# Altium schematic sheet FOTA MicroController Core.SchDoc: FOTA MicroController
size 292 x 193 mm; DocumentNumber: 45; SheetNumber: 30; SheetTotal: 42
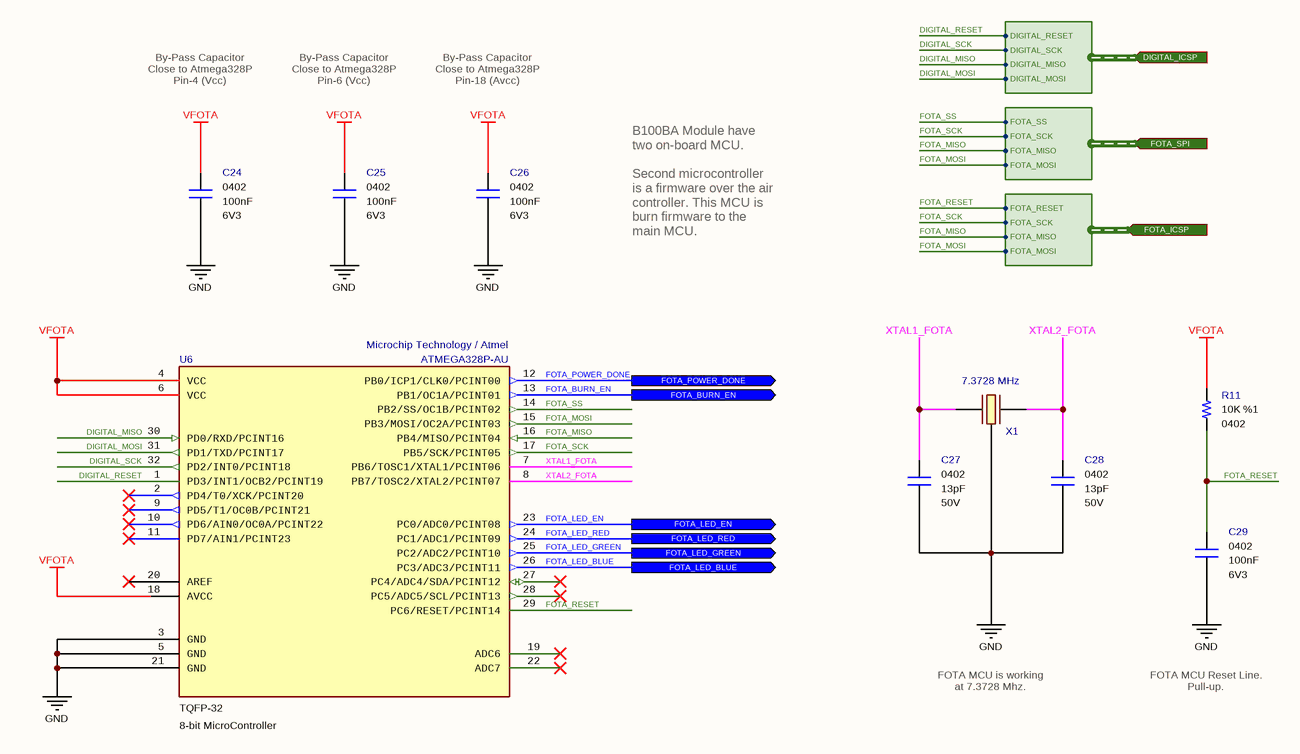
[diagram p0: FOTA MicroController Core.SchDoc]

## Parts
C24  value 100nF  Case: 0402  Voltage: 6V3  [CAPACITOR_0402]  (hidden comment: Multilayer Ceramic Capacitor)
C25  value 100nF  Case: 0402  Voltage: 6V3  [CAPACITOR_0402]  (hidden comment: Multilayer Ceramic Capacitor)
C26  value 100nF  Case: 0402  Voltage: 6V3  [CAPACITOR_0402]  (hidden comment: Multilayer Ceramic Capacitor)
C27  value 13pF  Voltage: 50V  Case: 0402  [CAPACITOR_0402]  (hidden comment: Multilayer Ceramic Capacitor)
C28  value 13pF  Voltage: 50V  Case: 0402  [CAPACITOR_0402]  (hidden comment: Multilayer Ceramic Capacitor)
C29  value 100nF  Case: 0402  Voltage: 6V3  [CAPACITOR_0402]  (hidden comment: Multilayer Ceramic Capacitor)
R11  value 10K  Tolerance: %1  Case: 0402  [RESISTOR_0402]  (hidden comment: Thick Film Resistor)
U6  8-bit MicroController  Case: TQFP-32  Manufacturer Part Number: ATMEGA328P-AU  Manufacturer Name: Microchip Technology / Atmel  [TQFP32]
X1  7.3728 MHz  [ABRACON_CRYSTAL]

## Ports
DIGITAL_ICSP (in, harness DIGITAL_ICSP), FOTA_BURN_EN (out), FOTA_ICSP (in, harness FOTA_ICSP), FOTA_LED_BLUE (out), FOTA_LED_EN (out), FOTA_LED_GREEN (out), FOTA_LED_RED (out), FOTA_POWER_DONE (out), FOTA_SPI (in, harness FOTA_SPI)

## Harnesses
FOTA_ICSP: FOTA_MOSI, FOTA_MISO, FOTA_SCK, FOTA_RESET
FOTA_SPI: FOTA_MOSI, FOTA_MISO, FOTA_SCK, FOTA_SS
DIGITAL_ICSP: DIGITAL_MOSI, DIGITAL_MISO, DIGITAL_SCK, DIGITAL_RESET

## Nets
GND: C24.1 C25.1 C26.1 C27.1 C28.1 C29.1 U6.3(GND) U6.5(GND) U6.21(GND) X1.2(GND)
VFOTA: C24.2 C25.2 C26.2 R11.2 U6.4(VCC) U6.6(VCC) U6.18(AVCC)
DIGITAL_MISO: U6.30(PD0/RXD/PCINT16) ; port DIGITAL_ICSP.DIGITAL_MISO
DIGITAL_MOSI: U6.31(PD1/TXD/PCINT17) ; port DIGITAL_ICSP.DIGITAL_MOSI
DIGITAL_RESET: U6.1(PD3/INT1/OCB2/PCINT19) ; port DIGITAL_ICSP.DIGITAL_RESET
DIGITAL_SCK: U6.32(PD2/INT0/PCINT18) ; port DIGITAL_ICSP.DIGITAL_SCK
FOTA_BURN_EN: U6.13(PB1/OC1A/PCINT01) ; port FOTA_BURN_EN
FOTA_LED_BLUE: U6.26(PC3/ADC3/PCINT11) ; port FOTA_LED_BLUE
FOTA_LED_EN: U6.23(PC0/ADC0/PCINT08) ; port FOTA_LED_EN
FOTA_LED_GREEN: U6.25(PC2/ADC2/PCINT10) ; port FOTA_LED_GREEN
FOTA_LED_RED: U6.24(PC1/ADC1/PCINT09) ; port FOTA_LED_RED
FOTA_MISO: U6.16(PB4/MISO/PCINT04) ; port FOTA_ICSP.FOTA_MISO, port FOTA_SPI.FOTA_MISO
FOTA_MOSI: U6.15(PB3/MOSI/OC2A/PCINT03) ; port FOTA_ICSP.FOTA_MOSI, port FOTA_SPI.FOTA_MOSI
FOTA_POWER_DONE: U6.12(PB0/ICP1/CLK0/PCINT00) ; port FOTA_POWER_DONE
FOTA_RESET: C29.2 R11.1 U6.29(PC6/RESET/PCINT14) ; port FOTA_ICSP.FOTA_RESET
FOTA_SCK: U6.17(PB5/SCK/PCINT05) ; port FOTA_ICSP.FOTA_SCK, port FOTA_SPI.FOTA_SCK
FOTA_SS: U6.14(PB2/SS/OC1B/PCINT02) ; port FOTA_SPI.FOTA_SS
XTAL1_FOTA: C27.2 U6.7(PB6/TOSC1/XTAL1/PCINT06) X1.3(OUT/IN)
XTAL2_FOTA: C28.2 U6.8(PB7/TOSC2/XTAL2/PCINT07) X1.1(IN/OUT)

Not connected (* = marked no-connect by the designer): U6 2(PD4/T0/XCK/PCINT20)* 9(PD5/T1/OC0B/PCINT21)* 10(PD6/AIN0/OC0A/PCINT22)* 11(PD7/AIN1/PCINT23)* 19(ADC6)* 20(AREF)* 22(ADC7)* 27(PC4/ADC4/SDA/PCINT12)* 28(PC5/ADC5/SCL/PCINT13)*; X1 4(GND)

## Notes on the sheet
- By-Pass Capacitor
  Close to Atmega328P
  Pin-4 (Vcc)
- By-Pass Capacitor
  Close to Atmega328P
  Pin-6 (Vcc)
- By-Pass Capacitor
  Close to Atmega328P
  Pin-18 (Avcc)
- B100BA Module have two on-board MCU.
  Second microcontroller is a firmware over the air controller. This MCU is burn firmware to the main MCU.
- FOTA MCU is working at 7.3728 Mhz.
- FOTA MCU Reset Line. Pull-up.
- © 2021 All rights reserved.
  This document may not, in whole or in part, be copied, photocopied, reproduced, translated or converted to any electronic or machine readable from without prior written permission of Mehmet Günce Akkoyun.
  Engineer contact : akkoyun@me.com
- Property of
- Engineer :
- Date :
- Size :
- A4
- Time :
- Project :
- Page :
- /
- Customer :
- Product ID :
- Module ID :
- Version :
- File :
- Revision :

## Library data of the parts
C24-C26 C29 = Capacitor - 100nF [0402-6V3]: Capacitor - 100nF [0402-6V3] (Ceramic); Manufacturer Name: AVX; Manufacturer Part Number: 04026D104KAT4A; Dielectric: X5R; Tolerance: %10; Height: 0.25mm; ComponentLink1Description: Mouser; ComponentLink1URL: https://www.mouser.com.tr/ProductDetail/AVX/04026D104KAT4A?qs=sGAEpiMZZMs0AnBnWHyRQPg4iYkCw7IMED%2F4kpqgf7w%3D; ComponentLink2Description: DataSheet; ComponentLink2URL: https://www.mouser.com.tr/datasheet/2/40/cx5r-776519.pdf; ROHS: Yes; Maximum Operating Temperature: +85; Minimum Operating Temperature: -55; Supplier 1: Avnet; Supplier Part Number 1: 04026D104KAT4A; Mouser Part Number: 581-04026D104KAT4A
C27 C28 = Capacitor - 13pF [0402-50V]: Capacitor - 13pF [0402] (Ceramic); Manufacturer Name: Kemet; Manufacturer Part Number: CBR04C130F5GAC; Dielectric: C0G; Tolerance: 1%; Height: 0.55mm; ROHS: Yes; Weight: 0.65mg; ComponentLink1Description: DataSheet; ComponentLink1URL: http://www.kemet.com/Lists/ProductCatalog/Attachments/490/KEM_C1030_CBR_SMD.pdf; ComponentLink2Description: Mouser; ComponentLink2URL: http://www.mouser.com/Search/ProductDetail.aspx?qs=kSX8PZDGYstn%252bRHasf81FA%3d%3d; Supplier 1: Mouser; Supplier 2: Farnell; Supplier 3: Digi-Key; Supplier Part Number 3: 399-8812-1-ND; Supplier Part Number 2: 2773390; Supplier Part Number 1: 80-CBR04C130F5GAC; Mouser Part Number: 80-CBR04C130F5GAC
R11 = Resistor - 10K: Thick Film Resistors - SMD 1/16 W 10 Kohms 1%; Manufacturer Name: Vishay; Manufacturer Part Number: CRCW040210K0FKED; Height: 0.4mm; ComponentLink1Description: DataSheet; ComponentLink1URL: https://www.mouser.com.tr/datasheet/2/427/dcrcwe3-1762152.pdf; ComponentLink2Description: Mouser; ComponentLink2URL: https://www.mouser.com.tr/ProductDetail/Vishay-Dale/CRCW040210K0FKED?qs=sGAEpiMZZMu61qfTUdNhG2DpbjADlD3GcalbOv9utCY%3D; Supplier 1: Mouser; Supplier 2: Digi-Key; Supplier Part Number 1: 71-CRCW040210K0FKEDH; Supplier Part Number 2: 541-10.0KYCT-ND; Mouser Part Number: 71-CRCW0402-10K-E3
U6 = IC - ATMEGA328P: 8-bit Microcontrollers - MCU 32KB In-system Flash 20MHz 1.8V-5.5V; Supply Voltage - Min: 1.8V; Supply Voltage - Max: 5.5V; Height: 1mm; ComponentLink1Description: DataSheet; ComponentLink1URL: http://ww1.microchip.com/downloads/en/DeviceDoc/ATmega48A-PA-88A-PA-168A-PA-328-P-DS-DS40002061A.pdf; ROHS: Yes; Minimum Operating Temperature: -40; Maximum Operating Temperature: +85; ComponentLink2Description: Mouser; ComponentLink2URL: https://www.mouser.com.tr/ProductDetail/Microchip-Technology-Atmel/ATMEGA328P-AU?qs=sGAEpiMZZMtVoztFdqDXO3RbBx7FKCmV; ComponentLink3Description: ProductPage; ComponentLink3URL: https://www.microchip.com/wwwproducts/en/ATmega328p; Supplier 1: Avnet; Supplier 2: Mouser; Supplier 3: Arrow; Supplier 4: Digi-Key; Supplier Part Number 1: ATMEGA328P-AU; Supplier Part Number 2: 556-ATMEGA328P-AU; Supplier Part Number 3: ATMEGA328P-AU; Supplier Part Number 4: ATMEGA328P-AU-ND; Mouser Part Number: 556-ATMEGA328P-AU
X1 = Crystal - 7.3728 MHz (Abracon): Crystals 7.3728MHz 18pF -40C +85C; Manufacturer Part Number: ABMM2-7.3728MHZ-E2-T; ESR: 150 Ohms; Frequency Stability: 20 ppm; Height: 1.2 mm; Frequency: 7.3728 MHz; Maximum Operating Temperature: +70; Minimum Operating Temperature: -20; ROHS: Yes; Tolerance: 20 ppm; ComponentLink1Description: DataSheet; ComponentLink1URL: https://www.ecsxtal.com/store/pdf/csm-8mr.pdf; ComponentLink2Description: Mouser; ComponentLink2URL: https://www.mouser.com/Search/Refine.aspx?Keyword=520-7.3-18-20BM-JENT; Supplier 1: Mouser; Supplier 2: Arrow; Supplier Part Number 2: ABMM2-7.3728MHZ-E2-T; Supplier Part Number 1: 815-ABMM2-7.3-E2-T; Manufacturer Name: ABRACON; Mouser Part Number: 815-ABMM2-7.3-E2-T; Case: SMD